# EAGLE schematic FA (EAGLE 9.3.0)
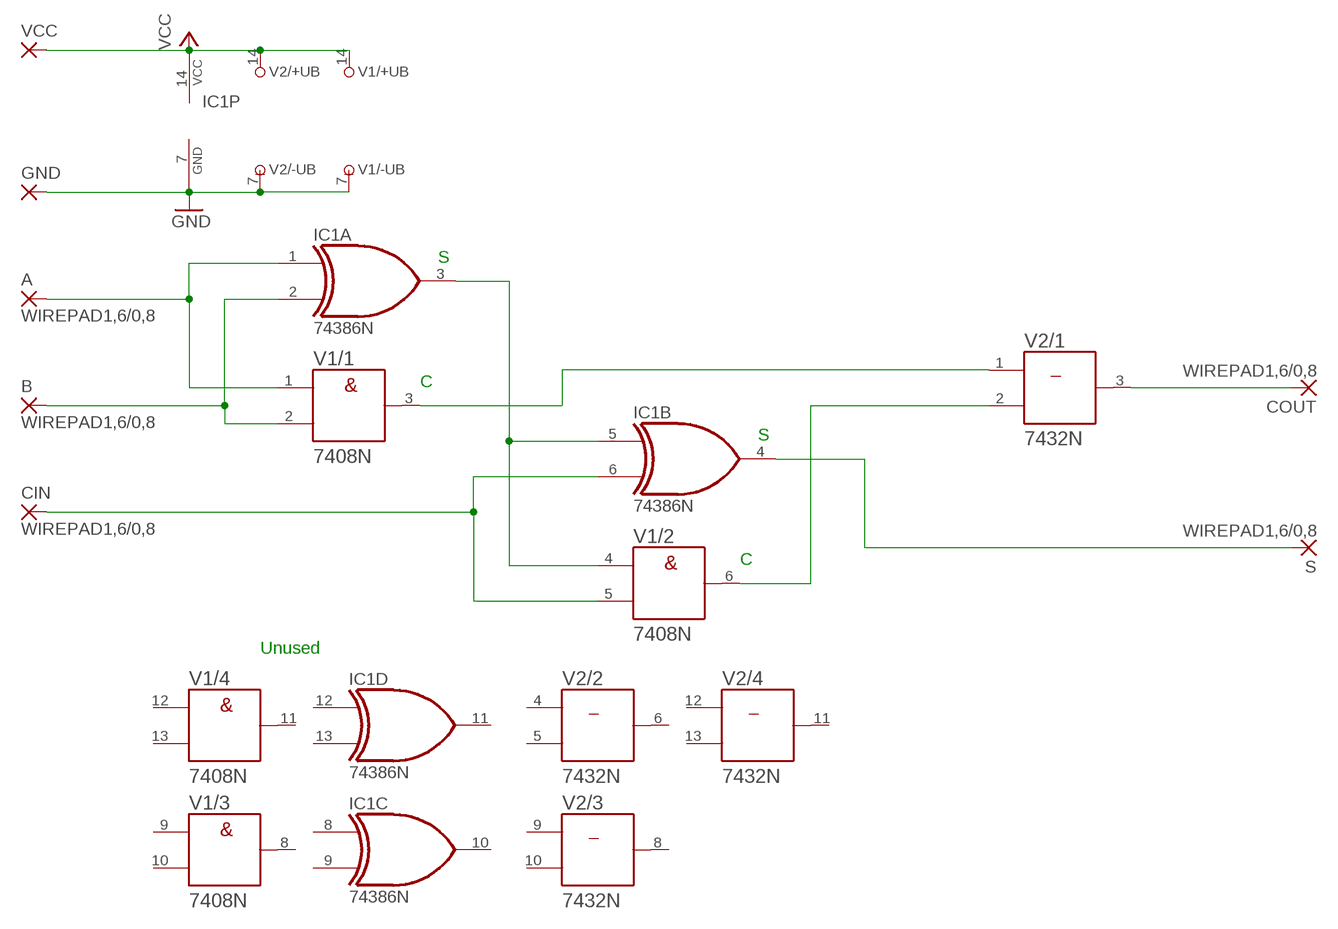
[diagram p0: schematic, sheet 1]

## Parts
A  WIREPAD1,6/0,8  [1,6/0,8]
B  WIREPAD1,6/0,8  [1,6/0,8]
CIN  WIREPAD1,6/0,8  [1,6/0,8]
COUT  WIREPAD1,6/0,8  [1,6/0,8]
GND  1,6/0,8  [1,6/0,8]
IC1  74386N  [DIL14]
S  WIREPAD1,6/0,8  [1,6/0,8]
V1  7408N  [DIL14]
V2  7432N  [DIL14]
VCC  1,6/0,8  [1,6/0,8]

## Nets
GND: GND.1(P) IC1.7(P:GND) V1.7(/-UB:-UB) V2.7(/-UB:-UB)
N$1: A.1(P) IC1.1(A:I0) V1.1(/1:A)
N$2: B.1(P) IC1.2(A:I1) V1.2(/1:B)
N$3: IC1.3(A:O) IC1.5(B:I0) V1.4(/2:A)
N$4: CIN.1(P) IC1.6(B:I1) V1.5(/2:B)
N$5: V1.3(/1:Y) V2.1(/1:A)
N$6: IC1.4(B:O) S.1(P)
N$7: V1.6(/2:Y) V2.2(/1:B)
N$11: COUT.1(P) V2.3(/1:Y)
VCC: IC1.14(P:VCC) V1.14(/+UB:+UB) V2.14(/+UB:+UB) VCC.1(P)
Unconnected: IC1.8(C:I0) IC1.9(C:I1) IC1.10(C:O) IC1.11(D:O) IC1.12(D:I0) IC1.13(D:I1) V1.8(/3:Y) V1.9(/3:A) V1.10(/3:B) V1.11(/4:Y) V1.12(/4:A) V1.13(/4:B) V2.4(/2:A) V2.5(/2:B) V2.6(/2:Y) V2.8(/3:Y) V2.9(/3:A) V2.10(/3:B) V2.11(/4:Y) V2.12(/4:A) V2.13(/4:B)

## Notes on the sheet
- S
- C
- S
- C
- Unused

## Library data of the parts
A B CIN COUT S = wirepad:WIREPAD: Wire PAD connect wire on PCB
GND VCC = wirepad:1,6/0,8: THROUGH-HOLE PAD
IC1 = 74xx-us:74*386: Quadruple 2-input EXCLUSIVE-OR (XOR) gate
V1 = 74ttl-din:74*08: Quad 2-input AND gate
V2 = 74ttl-din:74*32: Quad 2-input OR gate